# Altium schematic sheet Image_Rotation.SchDoc
size A; DocumentNumber: 1; SheetNumber: 1; SheetTotal: 1
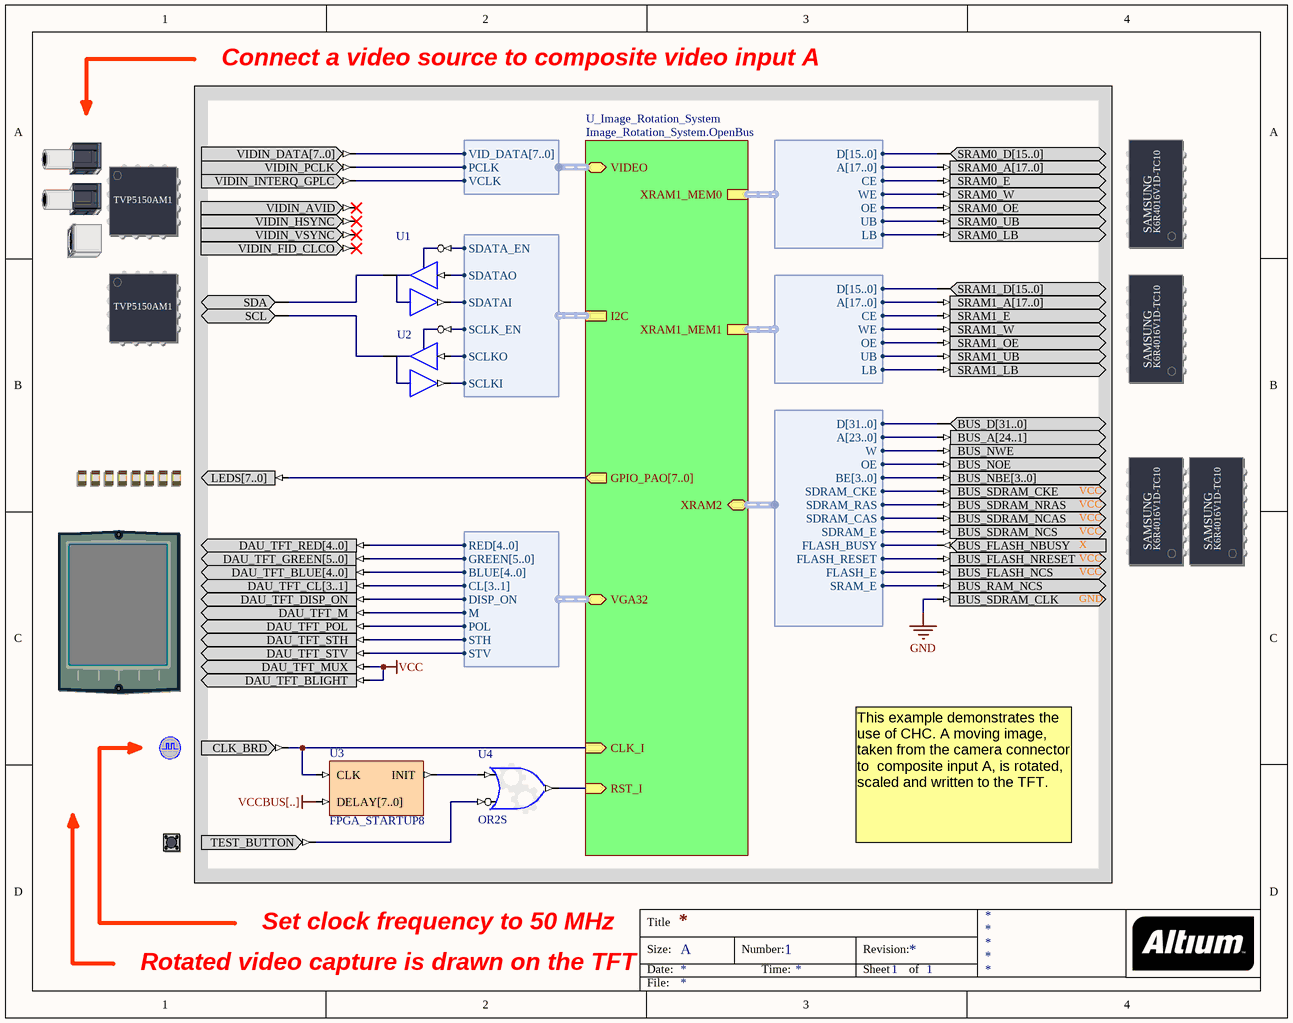
[diagram p0: Image_Rotation.SchDoc]

## Parts
(Parts that share a designator on the sheet are numbered #1, #2 ... from top to bottom, then left to right.)
?#1  VIDEO_INPUT  (value not drawn)
?#2  SRAM_DAUGHTER0  (value not drawn)
?#3  SRAM_DAUGHTER1  (value not drawn)
?#4  VIDEO_INPUT_CTRL  (value not drawn)
?#5  SHARED_SRAM_DAUGHTER  (value not drawn)
?#6  LED  (value not drawn)
?#7  TFT_LCD  (value not drawn)
?#8  CLOCK_BOARD  (value not drawn)
?#9  TEST_BUTTON  (value not drawn)
U1  IOBUF  (value not drawn)
U2  IOBUF  (value not drawn)
U3  FPGA_STARTUP8
U4  OR2S

## Blocks framed on the sheet
Connect a video source to composite video input A: ?#1-?#9 U1-U4

## Sub-sheets
U_Image_Rotation_System = Image_Rotation_System.OpenBus: RST_I (in), CLK_I (in), GPIO_PAO[7..0] (out), XRAM1_MEM0 (harness WB_MEM_CTRL_SRAM16_A18), XRAM1_MEM1 (harness WB_MEM_CTRL_SRAM16_A18), I2C (harness WB_I2CM), VGA32 (harness VGA32_TFT), XRAM2 (harness WB_SHARED_MEM_CTRL), VIDEO (harness BT656)

## Harnesses
WB_MEM_CTRL_SRAM16_A18: D[15..0], A[17..0], CE, WE, OE, UB, LB
WB_I2CM: SDATA_EN, SDATAO, SDATAI, SCLK_EN, SCLKO, SCLKI
VGA32_TFT: RED[4..0], GREEN[5..0], BLUE[4..0], CL[3..1], DISP_ON, M, POL, STH, STV
BT656: PCLK, VCLK, VID_DATA[7..0]
WB_SHARED_MEM_CTRL: A[23..0], BE[3..0], D[31..0], FLASH_BUSY, FLASH_E, FLASH_RESET, OE, SDRAM_CAS, SDRAM_CKE, SDRAM_E, SDRAM_RAS, SRAM_E, W

## Nets
GND: ?#5.BUS_SDRAM_CLK
VCC: ?#7.DAU_TFT_BLIGHT ?#7.DAU_TFT_MUX
VCCBUS[..]: U3.DELAY[7..0]
Net?#1_VIDIN_DATA[7..0]: ?#1.VIDIN_DATA[7..0] ; sheet U_Image_Rotation_System/VIDEO.VID_DATA[7..0]
Net?#1_VIDIN_INTERQ_GPLC: ?#1.VIDIN_INTERQ_GPLC ; sheet U_Image_Rotation_System/VIDEO.VCLK
Net?#1_VIDIN_PCLK: ?#1.VIDIN_PCLK ; sheet U_Image_Rotation_System/VIDEO.PCLK
Net?#2_SRAM0_A[17..0]: ?#2.SRAM0_A[17..0] ; sheet U_Image_Rotation_System/XRAM1_MEM0.A[17..0]
Net?#2_SRAM0_D[15..0]: ?#2.SRAM0_D[15..0] ; sheet U_Image_Rotation_System/XRAM1_MEM0.D[15..0]
Net?#2_SRAM0_E: ?#2.SRAM0_E ; sheet U_Image_Rotation_System/XRAM1_MEM0.CE
Net?#2_SRAM0_LB: ?#2.SRAM0_LB ; sheet U_Image_Rotation_System/XRAM1_MEM0.LB
Net?#2_SRAM0_OE: ?#2.SRAM0_OE ; sheet U_Image_Rotation_System/XRAM1_MEM0.OE
Net?#2_SRAM0_UB: ?#2.SRAM0_UB ; sheet U_Image_Rotation_System/XRAM1_MEM0.UB
Net?#2_SRAM0_W: ?#2.SRAM0_W ; sheet U_Image_Rotation_System/XRAM1_MEM0.WE
Net?#3_SRAM1_A[17..0]: ?#3.SRAM1_A[17..0] ; sheet U_Image_Rotation_System/XRAM1_MEM1.A[17..0]
Net?#3_SRAM1_D[15..0]: ?#3.SRAM1_D[15..0] ; sheet U_Image_Rotation_System/XRAM1_MEM1.D[15..0]
Net?#3_SRAM1_E: ?#3.SRAM1_E ; sheet U_Image_Rotation_System/XRAM1_MEM1.CE
Net?#3_SRAM1_LB: ?#3.SRAM1_LB ; sheet U_Image_Rotation_System/XRAM1_MEM1.LB
Net?#3_SRAM1_OE: ?#3.SRAM1_OE ; sheet U_Image_Rotation_System/XRAM1_MEM1.OE
Net?#3_SRAM1_UB: ?#3.SRAM1_UB ; sheet U_Image_Rotation_System/XRAM1_MEM1.UB
Net?#3_SRAM1_W: ?#3.SRAM1_W ; sheet U_Image_Rotation_System/XRAM1_MEM1.WE
Net?#4_SCL: ?#4.SCL U2.IO
Net?#4_SDA: ?#4.SDA U1.IO
Net?#5_BUS_A[24..1]: ?#5.BUS_A[24..1] ; sheet U_Image_Rotation_System/XRAM2.A[23..0]
Net?#5_BUS_D[31..0]: ?#5.BUS_D[31..0] ; sheet U_Image_Rotation_System/XRAM2.D[31..0]
Net?#5_BUS_FLASH_NBUSY: ?#5.BUS_FLASH_NBUSY ; sheet U_Image_Rotation_System/XRAM2.FLASH_BUSY
Net?#5_BUS_FLASH_NCS: ?#5.BUS_FLASH_NCS ; sheet U_Image_Rotation_System/XRAM2.FLASH_E
Net?#5_BUS_FLASH_NRESET: ?#5.BUS_FLASH_NRESET ; sheet U_Image_Rotation_System/XRAM2.FLASH_RESET
Net?#5_BUS_NBE[3..0]: ?#5.BUS_NBE[3..0] ; sheet U_Image_Rotation_System/XRAM2.BE[3..0]
Net?#5_BUS_NOE: ?#5.BUS_NOE ; sheet U_Image_Rotation_System/XRAM2.OE
Net?#5_BUS_NWE: ?#5.BUS_NWE ; sheet U_Image_Rotation_System/XRAM2.W
Net?#5_BUS_RAM_NCS: ?#5.BUS_RAM_NCS ; sheet U_Image_Rotation_System/XRAM2.SRAM_E
Net?#5_BUS_SDRAM_CKE: ?#5.BUS_SDRAM_CKE ; sheet U_Image_Rotation_System/XRAM2.SDRAM_CKE
Net?#5_BUS_SDRAM_NCAS: ?#5.BUS_SDRAM_NCAS ; sheet U_Image_Rotation_System/XRAM2.SDRAM_CAS
Net?#5_BUS_SDRAM_NCS: ?#5.BUS_SDRAM_NCS ; sheet U_Image_Rotation_System/XRAM2.SDRAM_E
Net?#5_BUS_SDRAM_NRAS: ?#5.BUS_SDRAM_NRAS ; sheet U_Image_Rotation_System/XRAM2.SDRAM_RAS
Net?#6_LEDS[7..0]: ?#6.LEDS[7..0] ; sheet U_Image_Rotation_System/GPIO_PAO[7..0]
Net?#7_DAU_TFT_BLUE[4..0]: ?#7.DAU_TFT_BLUE[4..0] ; sheet U_Image_Rotation_System/VGA32.BLUE[4..0]
Net?#7_DAU_TFT_CL[3..1]: ?#7.DAU_TFT_CL[3..1] ; sheet U_Image_Rotation_System/VGA32.CL[3..1]
Net?#7_DAU_TFT_DISP_ON: ?#7.DAU_TFT_DISP_ON ; sheet U_Image_Rotation_System/VGA32.DISP_ON
Net?#7_DAU_TFT_GREEN[5..0]: ?#7.DAU_TFT_GREEN[5..0] ; sheet U_Image_Rotation_System/VGA32.GREEN[5..0]
Net?#7_DAU_TFT_M: ?#7.DAU_TFT_M ; sheet U_Image_Rotation_System/VGA32.M
Net?#7_DAU_TFT_POL: ?#7.DAU_TFT_POL ; sheet U_Image_Rotation_System/VGA32.POL
Net?#7_DAU_TFT_RED[4..0]: ?#7.DAU_TFT_RED[4..0] ; sheet U_Image_Rotation_System/VGA32.RED[4..0]
Net?#7_DAU_TFT_STH: ?#7.DAU_TFT_STH ; sheet U_Image_Rotation_System/VGA32.STH
Net?#7_DAU_TFT_STV: ?#7.DAU_TFT_STV ; sheet U_Image_Rotation_System/VGA32.STV
Net?#8_CLK_BRD: ?#8.CLK_BRD U3.CLK ; sheet U_Image_Rotation_System/CLK_I
Net?#9_TEST_BUTTON: ?#9.TEST_BUTTON U4.I1
NetU1_I: U1.I ; sheet U_Image_Rotation_System/I2C.SDATAO
NetU1_O: U1.O ; sheet U_Image_Rotation_System/I2C.SDATAI
NetU1_T: U1.T ; sheet U_Image_Rotation_System/I2C.SDATA_EN
NetU2_I: U2.I ; sheet U_Image_Rotation_System/I2C.SCLKO
NetU2_O: U2.O ; sheet U_Image_Rotation_System/I2C.SCLKI
NetU2_T: U2.T ; sheet U_Image_Rotation_System/I2C.SCLK_EN
NetU3_INIT: U3.INIT U4.I0
NetU4_O: U4.O ; sheet U_Image_Rotation_System/RST_I

Not connected (* = marked no-connect by the designer): ?#1 VIDIN_AVID* VIDIN_FID_CLCO* VIDIN_HSYNC* VIDIN_VSYNC*

## Notes on the sheet
- This example demonstrates the use of CHC. A moving image, taken from the camera connector to  composite input A, is rotated, scaled and written to the TFT.
- Rotated video capture is drawn on the TFT
- Set clock frequency to 50 MHz
- Title
- Size:
- Date:
- A
- Number:
- Time:
- Revision:
- Sheet
- of
- File:
- (in symbol SHARED_SRAM_DAUGHTER) VCC; X; SAMSUNG; K6R4016V1D-TC10; GND
- (in symbol SRAM_DAUGHTER0) SAMSUNG; K6R4016V1D-TC10
- (in symbol SRAM_DAUGHTER1) SAMSUNG; K6R4016V1D-TC10
- (in symbol VIDEO_INPUT) TVP5150AM1
- (in symbol VIDEO_INPUT_CTRL) TVP5150AM1

## Library data of the parts
?#1 = VIDEO_INPUT: Video Inputs; PortComponent: True; Published: 22-Jan-2007; Publisher: Altium Limited; HelpURL: TR0145 Technical Reference for Altium's Audio-Video Peripheral Board PB01.pdf#page=7
?#2 = SRAM_DAUGHTER0: Free Static RAM - Daughterboard; PortComponent: True; Published: 14-May-2007; Publisher: Altium Limited; HelpURL: TR0143 NanoBoard Technical Reference Manual - NB2.pdf#page=24
?#3 = SRAM_DAUGHTER1: Free Static RAM - Daughterboard; PortComponent: True; Published: 14-May-2007; Publisher: Altium Limited; HelpURL: TR0143 NanoBoard Technical Reference Manual - NB2.pdf#page=24
?#4 = VIDEO_INPUT_CTRL: Video Input Control; PortComponent: True; Published: 22-Jan-2007; Publisher: Altium Limited; HelpURL: TR0145 Technical Reference for Altium's Audio-Video Peripheral Board PB01.pdf#page=8
?#5 = SHARED_SRAM_DAUGHTER: Common-Bus Static RAM - Daughterboard; PortComponent: True; Published: 14-May-2007; Publisher: Altium Limited; HelpURL: TR0149 Technical Reference for Altium's Xilinx Spartan-3 Daughter Board DB30.pdf#page=14
?#6 = LED: Bank of eight Red LEDs; PortComponent: True; Published: 19-Nov-2003; Publisher: Altium Limited; HelpURL: TR0143 NanoBoard Technical Reference Manual - NB2.pdf#page=45
?#7 = TFT_LCD: TFT LCD Panel; PortComponent: True; Published: 22-Jan-2007; Publisher: Altium Limited; HelpURL: TR0143 Technical Reference Manual for Altium's Desktop NanoBoard NB2DSK01.pdf#page=50
?#8 = CLOCK_BOARD: Global System Clock Supply; PortComponent: True; Published: 19-Nov-2003; Publisher: Altium Limited; HelpURL: TR0143 Technical Reference Manual for Altium's Desktop NanoBoard NB2DSK01.pdf#page=41; UseInDSF: True
?#9 = TEST_BUTTON: Test / Reset Button; PortComponent: True; Published: 19-Nov-2003; Publisher: Altium Limited; HelpURL: TR0143 Technical Reference Manual for Altium's Desktop NanoBoard NB2DSK01.pdf#page=53
U1 U2 = IOBUF: Input/Output Buffer; Enable: Low; Control: Common Control T; ArchiveName: GENERIC; VHDLIB_SIM: GENERIC_LIB; Published: 29-Jan-2004; Publisher: Altium Limited; XilinxEquivalent: IOBUF; LastRevisionNo: 1.00.00; HelpURL: CR0118 FPGA Generic Library Guide.pdf#page=293; ComponentLink1URL: CR0125 FPGA Buffer Resource Usage.pdf#page=78; ComponentLink1Description: Core &Resource Usage; FunctionalClass: Buffer; SubClass: IOBUF
U3 = FPGA_STARTUP8: FPGA Startup With 8 Bit Delay; Published: 9-Dec-2004; Publisher: Altium Limited; HelpURL: CR0119 FPGA_STARTUPx Powerup Delay Unit.pdf; LastRevisionNo: 1.00.00; ComponentLink1Description: Core &Resource Usage; ComponentLink1URL: CR0139 FPGA Peripheral Resource Usage.pdf#page=11
U4 = GATE: Configurable Generic Gate; ConfiguratorName: GENERIC_GATE; ConfigurationParameters: {}Version[1.0]{}GateKind[OR]{}BusInput[False]{}GateInputType[Bit]{}GateOutputOption[Normal]{}BusWidth[8]{}RegisterOutputs[False]{}NegativeClockEdge[False]{}InputCount[2]{}InputInvert0[False]{}InputInvert1[True]{}; LastRevisionNo: 1.00.00; Published: 3-Sep-2008; Publisher: Altium Limited